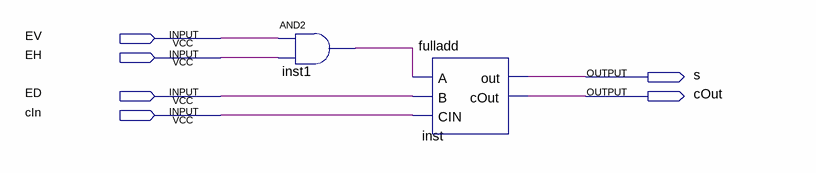
[diagram p0: schematic sheet]
// Quartus schematic mm.bdf as structural Verilog: 2 symbols, 6 pins
module mm (
  input  EV,
  input  EH,
  input  ED,
  input  cIn,
  output s,
  output cOut
);

  wire inst1_out;

  and inst1 (inst1_out, EV, EH);
  fulladd inst (.A(inst1_out), .B(ED), .CIN(cIn), .out(s), .cOut(cOut));
endmodule
